# Altium schematic sheet Connections.SchDoc: Expansion Connections
size A4; SheetNumber: 11; SheetTotal: 11; SheetSize: A4
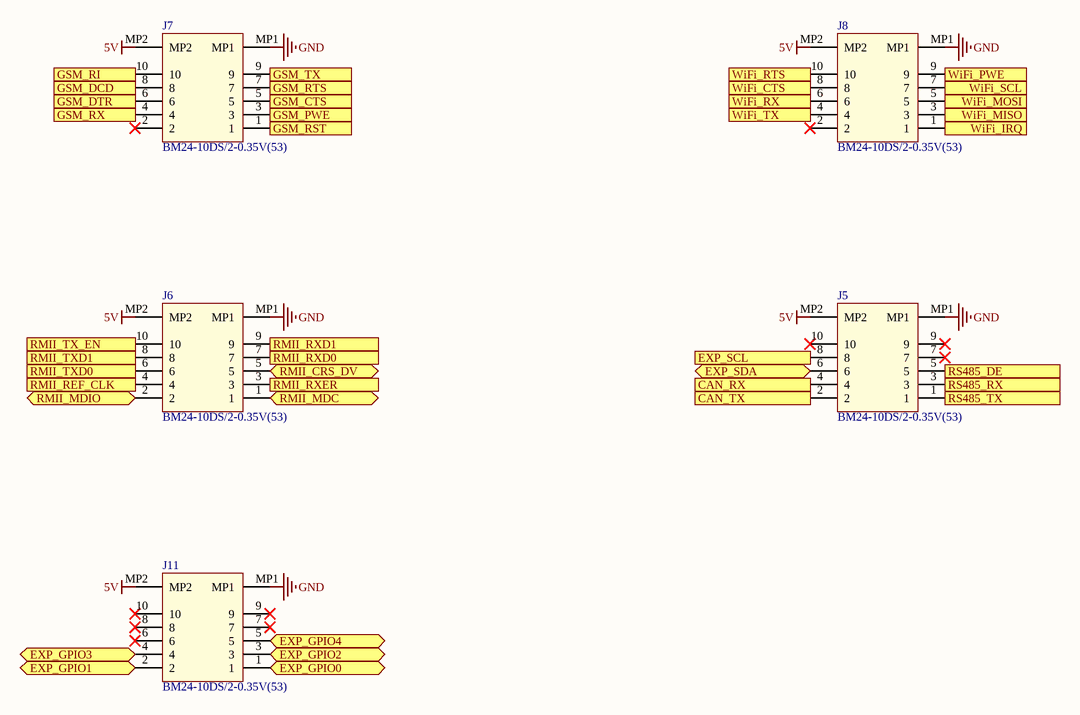
[diagram p0: Connections.SchDoc]

## Parts
J5  BM24-10DS/2-0.35V(53)  [HIROSE BM2410DS]
J6  BM24-10DS/2-0.35V(53)  [HIROSE BM2410DS]
J7  BM24-10DS/2-0.35V(53)  [HIROSE BM2410DS]
J8  BM24-10DS/2-0.35V(53)  [HIROSE BM2410DS]
J11  BM24-10DS/2-0.35V(53)  [HIROSE BM2410DS]

## Ports
CAN_RX (out), CAN_TX (in), EXP_GPIO0 (bidir), EXP_GPIO1 (bidir), EXP_GPIO2 (bidir), EXP_GPIO3 (bidir), EXP_GPIO4 (bidir), EXP_SCL (in), EXP_SDA (bidir), GSM_CTS (out), GSM_DCD (in), GSM_DTR (in), GSM_PWE (in), GSM_RI (out), GSM_RST (in), GSM_RTS (in), GSM_RX (out), GSM_TX (in), RMII_CRS_DV (bidir), RMII_MDC (bidir), RMII_MDIO (bidir), RMII_REF_CLK (in), RMII_RXD0 (out), RMII_RXD1 (out), RMII_RXER (out), RMII_TX_EN (in), RMII_TXD0 (in), RMII_TXD1 (in), RS485_DE (in), RS485_RX (out), RS485_TX (in), WiFi_CTS (out), WiFi_IRQ (out), WiFi_MISO (out), WiFi_MOSI (in), WiFi_PWE (in), WiFi_RTS (in), WiFi_RX (out), WiFi_SCL (in), WiFi_TX (in)

## Nets
5V: J5.MP2 J6.MP2 J7.MP2 J8.MP2 J11.MP2
GND: J5.MP1 J6.MP1 J7.MP1 J8.MP1 J11.MP1
CAN_RX: J5.4 ; port CAN_RX
CAN_TX: J5.2 ; port CAN_TX
EXP_GPIO0: J11.1 ; port EXP_GPIO0
EXP_GPIO1: J11.2 ; port EXP_GPIO1
EXP_GPIO2: J11.3 ; port EXP_GPIO2
EXP_GPIO3: J11.4 ; port EXP_GPIO3
EXP_GPIO4: J11.5 ; port EXP_GPIO4
EXP_SCL: J5.8 ; port EXP_SCL
EXP_SDA: J5.6 ; port EXP_SDA
GSM_CTS: J7.5 ; port GSM_CTS
GSM_DCD: J7.8 ; port GSM_DCD
GSM_DTR: J7.6 ; port GSM_DTR
GSM_PWE: J7.3 ; port GSM_PWE
GSM_RI: J7.10 ; port GSM_RI
GSM_RST: J7.1 ; port GSM_RST
GSM_RTS: J7.7 ; port GSM_RTS
GSM_RX: J7.4 ; port GSM_RX
GSM_TX: J7.9 ; port GSM_TX
RMII_CRS_DV: J6.5 ; port RMII_CRS_DV
RMII_MDC: J6.1 ; port RMII_MDC
RMII_MDIO: J6.2 ; port RMII_MDIO
RMII_REF_CLK: J6.4 ; port RMII_REF_CLK
RMII_RXD0: J6.7 ; port RMII_RXD0
RMII_RXD1: J6.9 ; port RMII_RXD1
RMII_RXER: J6.3 ; port RMII_RXER
RMII_TX_EN: J6.10 ; port RMII_TX_EN
RMII_TXD0: J6.6 ; port RMII_TXD0
RMII_TXD1: J6.8 ; port RMII_TXD1
RS485_DE: J5.5 ; port RS485_DE
RS485_RX: J5.3 ; port RS485_RX
RS485_TX: J5.1 ; port RS485_TX
WiFi_CTS: J8.8 ; port WiFi_CTS
WiFi_IRQ: J8.1 ; port WiFi_IRQ
WiFi_MISO: J8.3 ; port WiFi_MISO
WiFi_MOSI: J8.5 ; port WiFi_MOSI
WiFi_PWE: J8.9 ; port WiFi_PWE
WiFi_RTS: J8.10 ; port WiFi_RTS
WiFi_RX: J8.6 ; port WiFi_RX
WiFi_SCL: J8.7 ; port WiFi_SCL
WiFi_TX: J8.4 ; port WiFi_TX

Not connected (* = marked no-connect by the designer): J5 7* 9* 10*; J7 2*; J8 2*; J11 6* 7* 8* 9* 10*

## Notes on the sheet
- Title:
- Size:
- Project:
- Revision:
- Sheet
- of
- Date:
- YıLDıZ IoT
- Elperek Mahallesi
- Saray Sokak, No:12
- SAKARYA / TURKEY
- File:

## Library data of the parts
J5-J8 J11 = 12 Pin (10 + 2 Power) B2B Socket: Board to Board Connector; Manufacturer: Hirose; Connector Type: Socket; Mated Stacking Heights: 0.8mm; Pitch: 0.014inch; Supplier 1: Digi-Key; Supplier Part Number 1: H124928CT-ND; Manufacturer Part Number: BM24-10DS/2-0.35V(53); Stock 1: 2056; Pricing 1: 1 = 1,05000, 10 = 0,92600, 25 = 0,87120, 50 = 0,83500, 100 = 0,79860, 250 = 0,72600, 500 = 0,65340 (USD); RoHS: Yes; Mount: Surface Mount; Number of Pins: 10; Contact Plating: Gold; Packaging: Tape and Reel; Number of Rows: 2; ComponentLink1URL: https://media.digikey.com/pdf/Data%20Sheets/Hirose%20PDFs/BM24.pdf?src-supplier=Digi-Key; ComponentLink1Description: https://media.digikey.com/pdf/Data%20Sheets/Hirose%20PDFs/BM24.pdf?src-supplier=Digi-Key; ComponentLink2URL: https://www.hirose.com/product/download/?distributor=digikey&type=2d&lang=en&num=BM24-10DS/2-0.35V(53)&src-supplier=Digi-Key; ComponentLink2Description: https://www.hirose.com/product/download/?distributor=digikey&type=2d&lang=en&num=BM24-10DS/2-0.35V(53)&src-supplier=Digi-Key; ComponentLink3URL: https://www.hirose.com/product/en/download_file/key_name/BM24-10DS__2-0.35V%2853%29/category/Specification%20Sheet/doc_file_id/87041/?file_category_id=9&item_id=06772002153&is_series=&src-supplier=Digi-Key; ComponentLink3Description: https://www.hirose.com/product/en/download_file/key_name/BM24-10DS__2-0.35V%2853%29/category/Specification%20Sheet/doc_file_id/87041/?file_category_id=9&item_id=06772002153&is_series=&src-supplier=Digi-Key